# Altium schematic sheet SEN_REVC_1.SchDoc: Sensors
size 270 x 223 mm; SheetTotal: 3; Origin: Eagle; Date: 2019-04-04 11:51:56 PM; SheetNumber: 2; GateName_1: G$1; SymbolName_1: LETTER_L; LibraryName: frames; DeviceSetName: LETTER_L; GateName_2: G$2; SymbolName_2: DOCFIELD; Sheet: Sheet:; REV: REV:
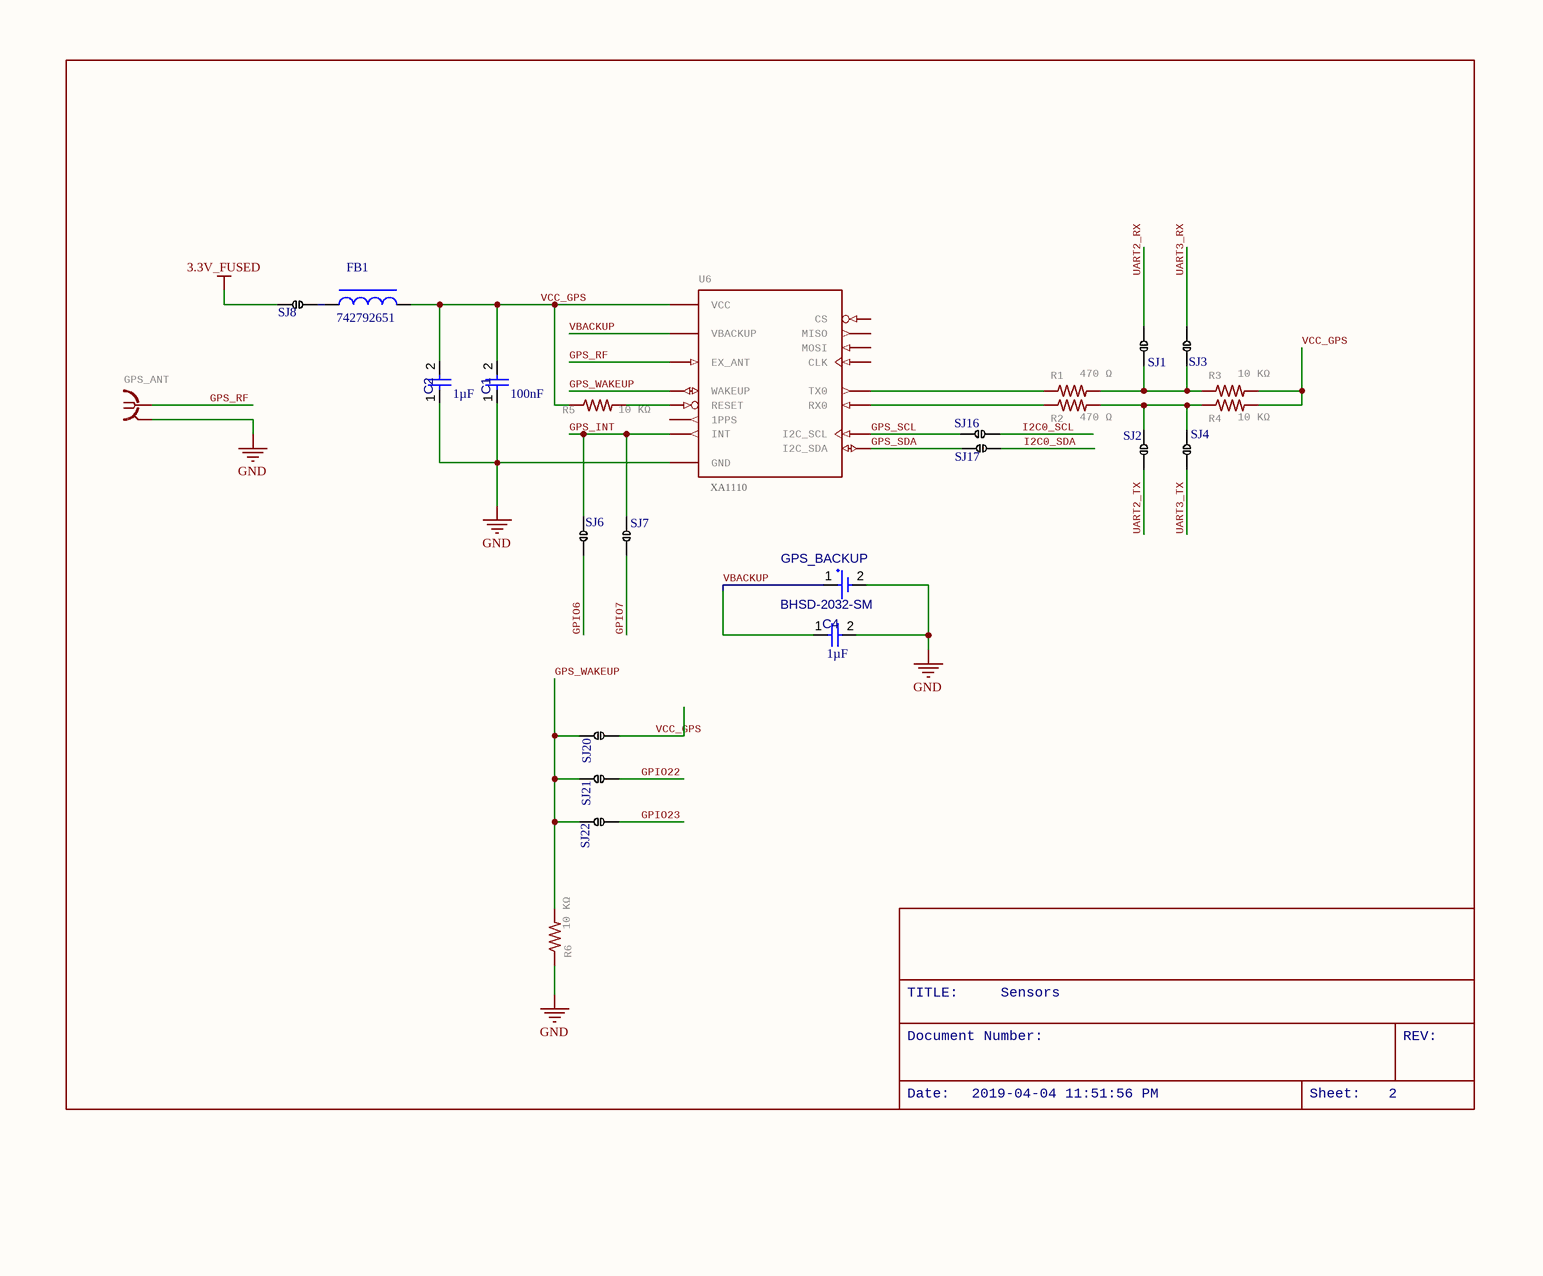
[diagram p0: SEN_REVC_1.SchDoc]

## Parts
C1  value 100nF  [CAPC2013X95X50LL10T25]  (hidden comment: Capacitor 100 nF +/-10% 50 V 0805)
C2  value 1µF  [CAPC2013X135X45NL10T25]  (hidden comment: Capacitor 1 uF +/- 10% 50 V 0805)
C4  value 1µF  [CAPC2013X135X45NL10T25]  (hidden comment: Capacitor 1 uF +/- 10% 50 V 0805)
FB1  742792651  [FP-742792651-MFG]
GPS_ANT  142-0701-801  [CINC-142-0701-801_V]  (value not drawn)
GPS_BACKUP  BHSD-2032-SM  [BHSD-2032-SM-Footprint-1]
R1  470 Ω  [6-0805_N]
R2  470 Ω  [6-0805_N]
R3  10 KΩ  [6-0805_N]
R4  10 KΩ  [6-0805_N]
R5  10 KΩ  [6-0805_N]
R6  10 KΩ  [6-0805_N]
SJ1  Solder Jumper  [Solder Jumper-Footprint-1]  (value not drawn)
SJ2  Solder Jumper  [Solder Jumper-Footprint-1]  (value not drawn)
SJ3  Solder Jumper  [Solder Jumper-Footprint-1]  (value not drawn)
SJ4  Solder Jumper  [Solder Jumper-Footprint-1]  (value not drawn)
SJ6  Solder Jumper  [Solder Jumper-Footprint-1]  (value not drawn)
SJ7  Solder Jumper  [Solder Jumper-Footprint-1]  (value not drawn)
SJ8  Solder Jumper  [Solder Jumper-Footprint-1]  (value not drawn)
SJ16  Solder Jumper  [Solder Jumper-Footprint-1]  (value not drawn)
SJ17  Solder Jumper  [Solder Jumper-Footprint-1]  (value not drawn)
SJ20  Solder Jumper  [Solder Jumper-Footprint-1]  (value not drawn)
SJ21  Solder Jumper  [Solder Jumper-Footprint-1]  (value not drawn)
SJ22  Solder Jumper  [Solder Jumper-Footprint-1]  (value not drawn)
U6  XA1110  [XA1110-Footprint-1]

## Nets
3.3V_FUSED: SJ8.0
GND: C1.1 C2.1 C4.2 GPS_ANT.GND,GND2(GND@1) GPS_BACKUP.2(-) R6.1 U6.P$1,3,4,5,6,9,10,11,24(GND)
GPIO6: SJ6.1
GPIO7: SJ7.1
GPIO22: SJ21.1
GPIO23: SJ22.1
GPS_INT: SJ6.0 SJ7.0 U6.P$16(INT)
GPS_RF: GPS_ANT.RF U6.P$2(EX_ANT)
GPS_SCL: SJ16.0 U6.P$14(I2C_SCL)
GPS_SDA: SJ17.0 U6.P$13(I2C_SDA)
GPS_WAKEUP: R6.2 SJ20.0 SJ21.0 SJ22.0 U6.P$12(WAKEUP)
I2C0_SCL: SJ16.1
I2C0_SDA: SJ17.1
UART2_RX: SJ1.1
UART2_TX: SJ2.1
UART3_RX: SJ3.1
UART3_TX: SJ4.1
VBACKUP: C4.1 GPS_BACKUP.1(+) U6.P$8(VBACKUP)
VCC_GPS: C1.2 C2.2 FB1.2 R3.2 R4.2 R5.1 SJ20.1 U6.P$7(VCC)
NetFB1_1: FB1.1 SJ8.1
NetR1_1: R1.1 U6.P$19(TX0)
NetR1_2: R1.2 R3.1 SJ1.0 SJ3.0
NetR2_1: R2.1 U6.P$20(RX0)
NetR2_2: R2.2 R4.1 SJ2.0 SJ4.0
NetR5_2: R5.2 U6.P$22(RESET)

Not connected (* = marked no-connect by the designer): U6 P$15(MISO) P$17(MOSI) P$18(CLK) P$21(1PPS) P$23(CS)

## Notes on the sheet
- TITLE:
- Sensors
- Document Number:
- REV:
- Date:
- 2019-04-04 11:51:56 PM
- Sheet:
- 2

## Library data of the parts
C1 = CMP-001-00018-6: Chip Capacitor, 100 nF, +/- 10%, 50 V, 0805 (2012 Metric); Capacitor Type: Ceramic; Voltage Rating: 50V; Pins: 2; Max Operating Temperature: 125°C; Min Operating Temperature: -55°C; Mounting Technology: SM; Case/Package: 0805; RoHS Compliant: True; Tolerance: 10%
C2 C4 = CMP-001-00007-6: Chip Capacitor, 1 uF, +/- 10%, 50 V, 0805 (2012 Metric); Capacitor Type: Ceramic; Voltage Rating: 50V; Min Operating Temperature: -55°C; RoHS Compliant: True; Mounting Technology: SM; Case/Package: 0805; Max Operating Temperature: 125°C; Tolerance: 10%; Pins: 2
FB1 = CMP-00022-1: Ferrite Beads WE-CBF 0603 SMD Bead 100MHz 600Ohm 1000mA; Max Current Rating: 1A; Tolerance: 25%; Value: 200mR; Number of Lines: 1; Impedance: 600R; Min Operating Temperature: -55°C; Depth: 0.8mm; Mounting Technology: Surface Mount; Height: 0.8mm; RoHS Compliant: Yes; Package Quantity: 1; Lead Free: Lead Free; Max Operating Temperature: 125°C; Case Code (Imperial): 0603; Case/Package: SMD/SMT; Max DC Current: 1A; Width: 0.8mm; Core Material: Ferrite; Material: Ferrite; Test Frequency: 100MHz; Termination: SMD/SMT; DC Resistance (DCR): 200mR; Weight: 0.000141oz; Packaging: Tape and Reel; Length: 1.6mm; Series: WE-CBF; Case Code (Metric): 1608; Current Rating: 1A
GPS_ANT = CMP-004-000004-3: RF Connectors / Coaxial Connectors SMA ST PCB-JCK STD EMT; pin to pad: GND,GND2>2+3+4+5 RF>1; GateName_1: G$1; SymbolName_1: BNC-F2; Gender: Female; Voltage Rating: 500V; Connector Type: SMA,Coaxial; Plating: Gold; Dielectric Material: PTFE; Mating Cycles: 500; Clock Frequency: 18GHz; Number of Ports: 1; Body Material: Brass; Impedance: 50R; Polarity: Standard; LibraryName: CU inSpace 2019 Parts; DeviceSetName: 5MMSMA; Design Item ID: 5MMSMA; Mounting Technology: Edge; Housing Color: Gold; Operating Frequency: N/A; Lead Free: Lead Free; Radiation Hardening: No; Case/Package: SMA; Fastening Type: Threaded; Orientation: Straight; Max Operating Temperature: 165°C; Package: 5MMSMA; RoHS Compliant: No; Depth: 16.26mm; Length: 6.35mm; Min Operating Temperature: -65°C; Termination: Solder; Series: 73251; Body Plating: Gold; Packaging: Bulk; Package Quantity: 1600; Insulation Material: Polytetrafluoroethylene; Contact Plating: Gold; Contact Material: Copper; Source: CU inSpace 2019 Parts.SCHLIB; Halogen Free: Low Halogen; Center Contact Plating: Gold
GPS_BACKUP = CMP-001-0000-2: Battery Holder 1 Cells Liquid Crystal Polymer Vectra T/R
R1-R6 = R-US_R1206: RESISTOR, American symbol; GateName_1: G$1; SymbolName_1: R-US; DeviceName: R1206; DeviceSetName: R-US_; LibraryName: rcl; SPICEPREFIX: R
SJ1-SJ4 SJ6-SJ8 SJ16 SJ17 SJ20-SJ22 = CMP-00020-3: pin to pad: 0>1 1>2
U6 = CMP-002-000018-2: Rx Txrx Module Surface Mount; pin to pad: P$1,3,4,5,6,9,10,11,24>1+3+4+5+6+9+10+11+24 P$2>2 P$7>7 P$8>8 P$12>12 P$13>13 P$14>14 P$15>15 P$16>16 P$17>17 P$18>18 P$19>19 P$20>20 P$21>21 P$22>22 P$23>23; GateName_1: G$1; SymbolName_1: XA1110; LibraryName: Sensors Board; DeviceSetName: XA1110; Source: Sensors Board.SCHLIB; Pin Count: 16; Design Item ID: XA1110; Package: XA1110; Component Type: Standard